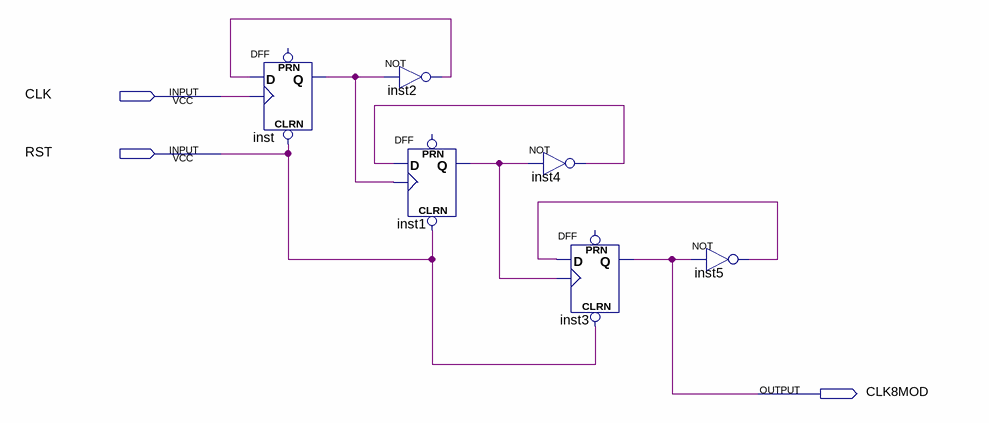
[diagram p0: schematic sheet]
// Quartus schematic divby8.bdf as structural Verilog: 6 symbols, 3 pins
module divby8 (
  input  CLK,
  input  RST,
  output CLK8MOD
);

  wire inst1_q, inst2_out, inst4_out, inst5_out, inst_q;

  DFF inst (.CLRN(RST), .CLK(CLK), .D(inst2_out), .Q(inst_q));  // open: PRN
  not inst2 (inst2_out, inst_q);
  DFF inst1 (.CLRN(RST), .CLK(inst_q), .D(inst4_out), .Q(inst1_q));  // open: PRN
  not inst4 (inst4_out, inst1_q);
  DFF inst3 (.CLRN(RST), .CLK(inst1_q), .D(inst5_out), .Q(CLK8MOD));  // open: PRN
  not inst5 (inst5_out, CLK8MOD);
endmodule
